# EAGLE design 10DOFATMEGAWSD (EAGLE 7.5.0)
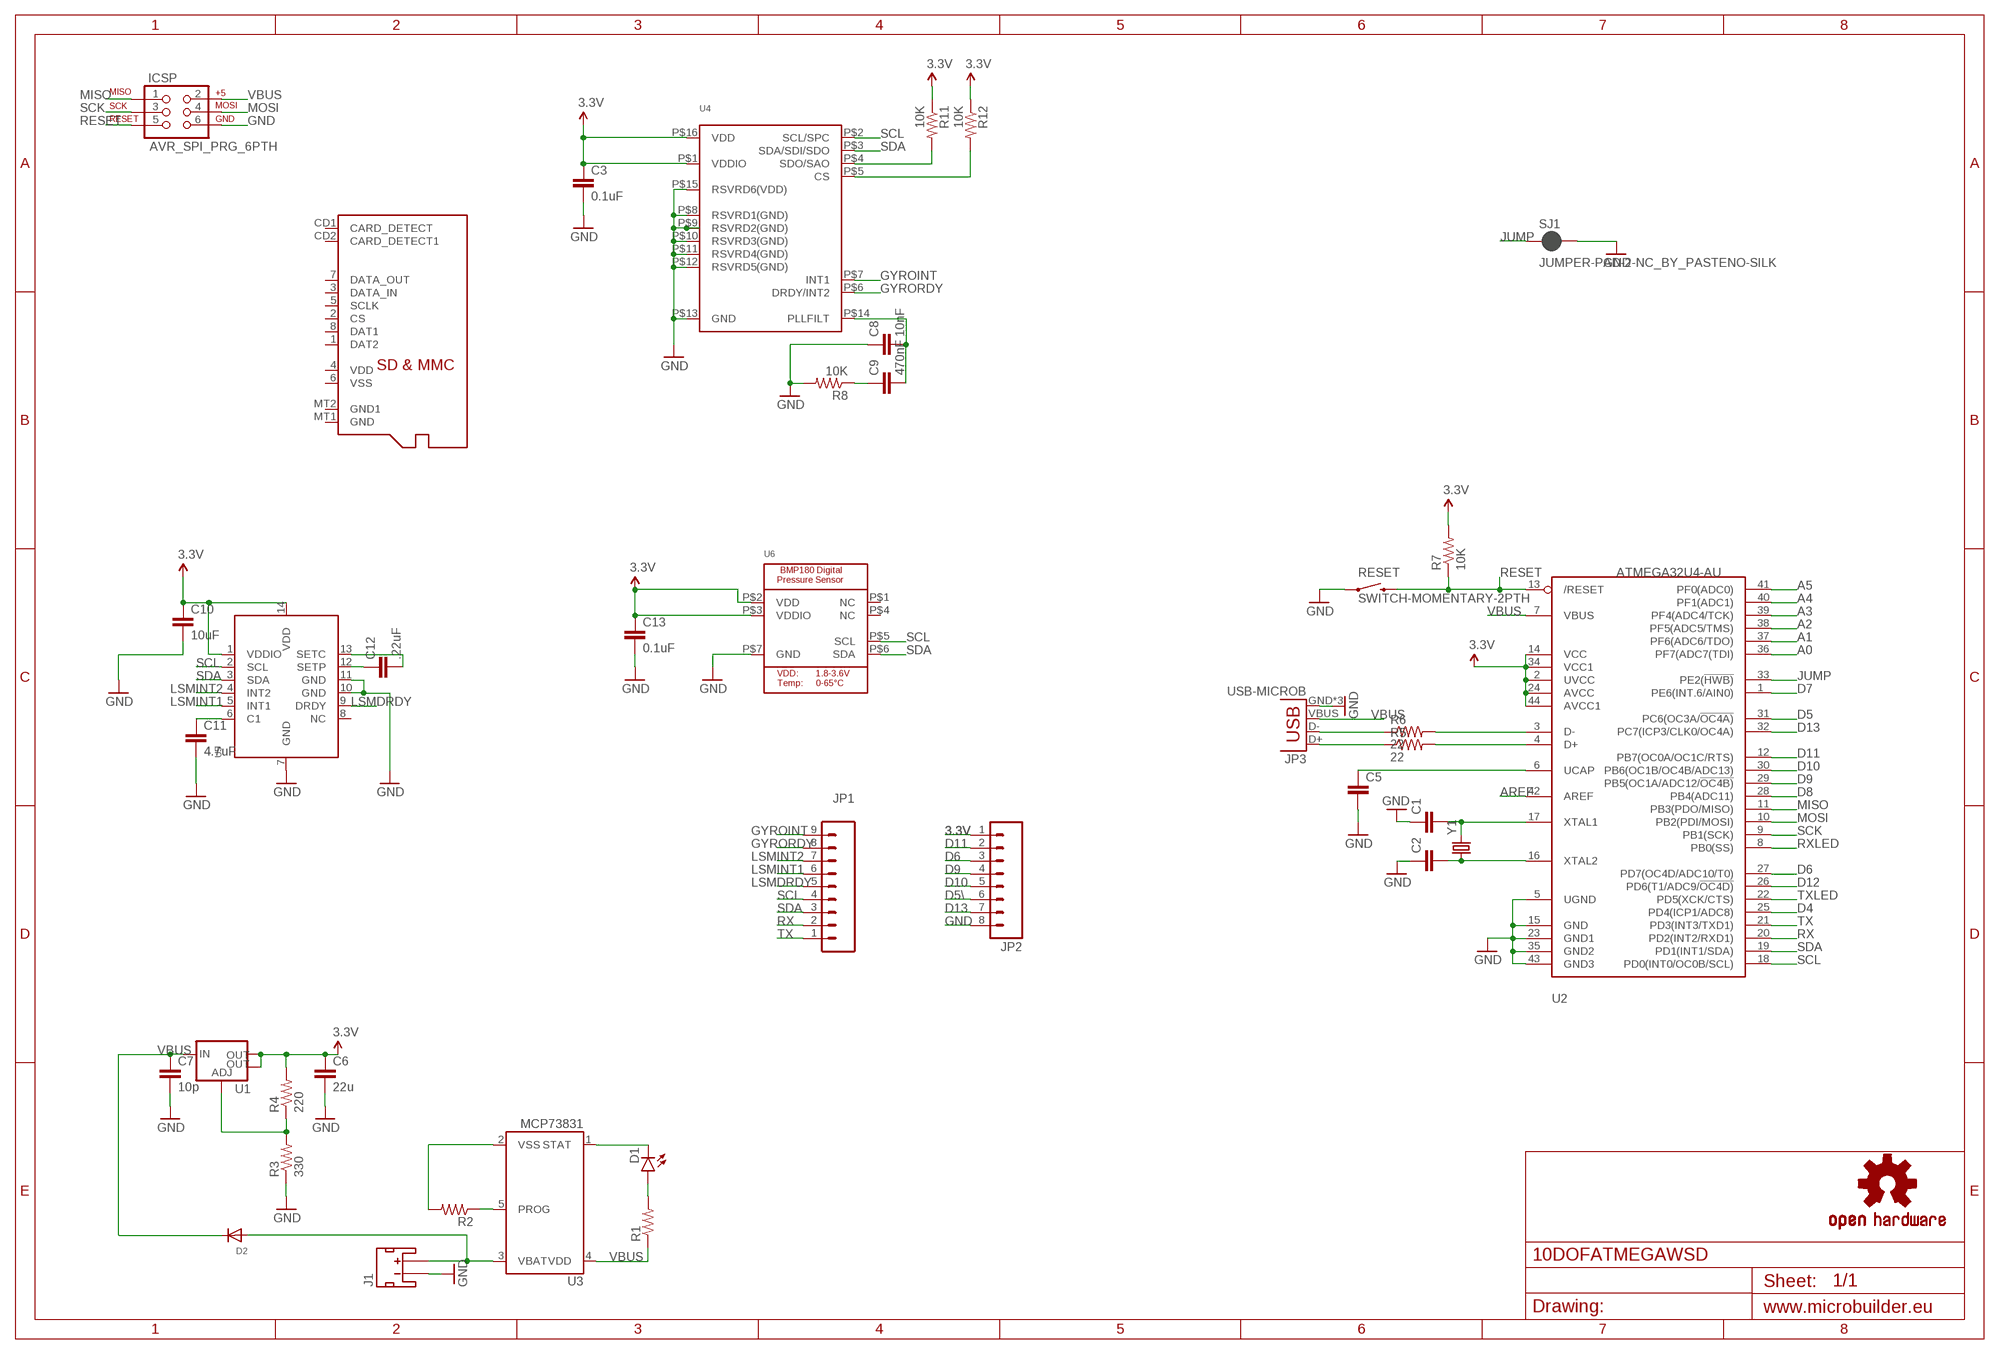
[diagram p0: schematic, sheet 1]

## Parts
C1  CAP0603-CAP  [0603-CAP]
C2  CAP0603-CAP  [0603-CAP]
C3  0.1uF  CAP0603-CAP  [0603-CAP]
C5  CAP0603-CAP  [0603-CAP]
C6  22u  CAP0603-CAP  [0603-CAP]
C7  10p  CAP0603-CAP  [0603-CAP]
C8  10nF  CAP0603-CAP  [0603-CAP]
C9  470nF  CAP0603-CAP  [0603-CAP]
C10  10uF  CAP0603-CAP  [0603-CAP]
C11  4.7uF  CAP0603-CAP  [0603-CAP]
C12  .22uF  CAP0603-CAP  [0603-CAP]
C13  0.1uF  CAP0603-CAP  [0603-CAP]
D1  LED3MM  [LED3MM]
D2  DIODESOT23_REFLOW  [SOT23-R]
ICSP  AVR_SPI_PRG_6PTH  [2X3]
J1  JST_2MM_MALE  [JST-2-SMD]
JP1  M09  [1X09]
JP2  M08  [1X08_ROUND]
JP3  USB-MICROB  [USB-MICROB]
LOGO1  OSHW-LOGOS-COPPER  [OSHW-LOGO-S_COPPER]
R1  RESISTOR0603-RES  [0603-RES]
R2  RESISTOR0603-RES  [0603-RES]
R3  330  RESISTOR0603-RES  [0603-RES]
R4  220  RESISTOR0603-RES  [0603-RES]
R5  22  RESISTOR0603-RES  [0603-RES]
R6  22  RESISTOR0603-RES  [0603-RES]
R7  10K  10KOHM-1/10W-1%(0603)0603  [0603-RES]
R8  10K  10KOHM-1/10W-1%(0603)0603  [0603-RES]
R11  10K  10KOHM-1/10W-1%(0603)0603  [0603-RES]
R12  10K  10KOHM-1/10W-1%(0603)0603  [0603-RES]
RESET  SWITCH-MOMENTARY-2PTH  [TACTILE-PTH]
SJ1  JUMPER-PAD-2-NC_BY_PASTENO-SILK  [PAD-JUMPER-2-NC_BY_PASTE_NO_SILK]
U1  V_REG_LM1117SOT223  [SOT223]
U2  ATMEGA32U4-AU  [TQFP44]
U3  MCP73831  [SOT23-5]
U4  GYRO_L3G2400D  [L3G4200D_LGA16L]
U5  LSM303DLHC  [LGA14]
U6  BMP180EXT  [BMP180_EXTENDED]
U$1  MICROSD  [MICROSD]
Y1  CRYSTALHC49US  [HC49US]

## Nets
3.3V: C3.1 C6.1 C10.1 C13.1 JP2.1 R4.2 R7.2 R11.1 R12.1 U1.2(OUT) U1.4(OUT) U2.2(UVCC) U2.14(VCC) U2.24(AVCC) U2.34(VCC1) U2.44(AVCC1) U4.P$1(VDDIO) U4.P$16(VDD) U5.1(VDDIO) U5.14(VDD) U6.P$2(VDD) U6.P$3(VDDIO)
A0: U2.36(PF7(ADC7(TDI))
A1: U2.37(PF6(ADC6/TDO))
A2: U2.38(PF5(ADC5/TMS))
A3: U2.39(PF4(ADC4/TCK))
A4: U2.40(PF1(ADC1))
A5: U2.41(PF0(ADC0))
AREF: U2.42(AREF)
D4: U2.25(PD4(ICP1/ADC8))
D5: U2.31(PC6(OC3A/!OC4A))
D5\: JP2.6
D6: JP2.3 U2.27(PD7(OC4D/ADC10/T0))
D7: U2.1(PE6(INT.6/AIN0))
D8: U2.28(PB4(ADC11))
D9: JP2.4 U2.29(PB5(OC1A/ADC12/!OC4B))
D10: JP2.5 U2.30(PB6(OC1B/OC4B/ADC13))
D11: JP2.2 U2.12(PB7(OC0A/OC1C/RTS))
D12: U2.26(PD6(T1/ADC9/!OC4D))
D13: JP2.7 U2.32(PC7(ICP3/CLK0/OC4A))
GND: C1.1 C2.1 C3.2 C5.2 C6.2 C7.2 C8.1 C10.2 C11.2 C13.2 ICSP.6 J1.1(-) JP2.8 JP3.GND JP3.MT1(GND) JP3.MT2(GND) R3.1 R8.2 RESET.1 SJ1.2 U2.5(UGND) U2.15(GND) U2.23(GND1) U2.35(GND2) U2.43(GND3) U4.P$8(RSVRD1(GND)) U4.P$9(RSVRD2(GND)) U4.P$10(RSVRD3(GND)) U4.P$11(RSVRD4(GND)) U4.P$12(RSVRD5(GND)) U4.P$13(GND) U4.P$15(RSVRD6(VDD)) U5.7(GND) U5.10(GND) U5.11(GND) U6.P$7(GND)
GYROINT: JP1.9 U4.P$7(INT1)
GYRORDY: JP1.8 U4.P$6(DRDY/INT2)
JUMP: SJ1.1 U2.33(PE2(!HWB))
LSMDRDY: JP1.5 U5.9(DRDY)
LSMINT1: JP1.6 U5.5(INT1)
LSMINT2: JP1.7 U5.4(INT2)
MISO: ICSP.1 U2.11(PB3(PDO/MISO))
MOSI: ICSP.4 U2.10(PB2(PDI/MOSI))
N$1: C2.2 U2.16(XTAL2) Y1.1
N$2: C1.2 U2.17(XTAL1) Y1.2
N$3: R5.2 U2.4(D+)
N$4: R6.2 U2.3(D-)
N$6: R2.1 U3.5(PROG)
N$7: R2.2 U3.2(VSS)
N$8: D1.K(C) U3.1(STAT)
N$9: D1.A R1.2
N$10: JP3.D+ R5.1
N$11: R3.2 R4.1 U1.1(ADJ)
N$12: JP3.D- R6.1
N$21: R11.2 U4.P$4(SDO/SAO)
N$22: D2.1(A) J1.2(+) U3.3(VBAT)
N$23: R12.2 U4.P$5(CS)
N$24: C8.2 C9.2 U4.P$14(PLLFILT)
N$26: C9.1 R8.1
N$28: C11.1 U5.6(C1)
N$31: C12.2 U5.13(SETC)
N$32: C12.1 U5.12(SETP)
N$69: C5.1 U2.6(UCAP)
RESET: ICSP.5 R7.1 RESET.3 U2.13(/RESET)
RX: JP1.2 U2.20(PD2(INT2/RXD1))
RXLED: U2.8(PB0(SS))
SCK: ICSP.3 U2.9(PB1(SCK))
SCL: JP1.4 U2.18(PD0(INT0/OC0B/SCL)) U4.P$2(SCL/SPC) U5.2(SCL) U6.P$5(SCL)
SDA: JP1.3 U2.19(PD1(INT1/SDA)) U4.P$3(SDA/SDI/SDO) U5.3(SDA) U6.P$6(SDA)
TX: JP1.1 U2.21(PD3(INT3/TXD1))
TXLED: U2.22(PD5(XCK/CTS))
VBUS: C7.1 D2.3(C) ICSP.2 JP3.VBUS R1.1 U1.3(IN) U2.7(VBUS) U3.4(VDD)
Unconnected: J1.NC1(PAD1) J1.NC2(PAD2) U5.8(NC) U6.P$1(NC) U6.P$4(NC) U$1.1(DAT2) U$1.2(CS) U$1.3(DATA_IN) U$1.4(VDD) U$1.5(SCLK) U$1.6(VSS) U$1.7(DATA_OUT) U$1.8(DAT1) U$1.CD1(CARD_DETECT) U$1.CD2(CARD_DETECT1) U$1.MT1(GND) U$1.MT2(GND1)

## Library data of the parts
C1-C3 C5-C13 = SparkFun-Capacitors:CAP: Capacitor Standard 0603 ceramic capacitor, and 0.1" leaded capacitor.
D1 = SparkFun-LED:LED: LEDs Standard schematic elements and footprints for 5mm, 3mm, 1206, and 0603 sized LEDs. 5mm - Spark Fun Electronics SKU : COM-00529 (and others)
D2 = adafruit:DIODE: Diode SMADIODE - SMA Surface Mount Package 20V 1A Schottky Diode Digikey: 641-1014-6-ND DO-1N4148 - Through Hole Small Current Diode SOD-123 20V 1 A (.5mV Vf) Schottky Diode - Digikey: MBRX120TPMSCT-ND SOD-323 10V 570mA (.38mV Vf, 3ns) Schottky Diode - Digikey: ZLLS410CT-ND SOD-523 30V 30mA Schottky Diode (RB751S-40TE61) - Digikey: RB751S-40TE61CT-ND SOT23-R/W - SOT23 Package (R = Solder Paste/Reflow Ovens, W = Hand-Soldering) BAT54Film 40V 300mA - Digikey: 497-7162-1-ND
ICSP = SparkFun-Connectors:AVR_SPI_PRG_6: AVR ISP 6 Pin This is the reduced ISP connector for AVR programming. Common on Arduino. This footprint will take up less PCB space and can be used with a 10-pin to 6-pin adapter such as SKU: BOB-08508 **Special note about "TEST_POINT" package. The stop mask is on the top side, so if you want your programming test points to be on the bottom of your board, make sure to place this package on the bottom side of the board. This also ensure that the orientation to program from the bottom side will be correct.
J1 = SparkFun-Connectors:JST_2MM_MALE: Mates to single-cell LiPo batteries. CONN-11443 Now with smashable polarity marks!; BTM_NEG: -; BTM_POS: +; PROD_ID: CONN-11443; TOP_NEG: -; TOP_POS: +
JP1 = SparkFun-Connectors:M09: Header 9 Standard 9-pin 0.1" header. Use with straight break away headers (SKU : PRT-00116), right angle break away headers (PRT-00553), swiss pins (PRT-00743), machine pins (PRT-00117), and female headers (PRT-00115).
JP2 = SparkFun-Connectors:M08: Header 8 Standard 8-pin 0.1" header. Use with straight break away headers (SKU : PRT-00116), right angle break away headers (PRT-00553), swiss pins (PRT-00743), machine pins (PRT-00117), and female headers (PRT-00115).
JP3 = SparkFun-Connectors:USB: USB Connectors USB-B-PTH is fully proven SKU : PRT-00139/CONN-08278 USB-miniB is fully proven SKU : PRT-00587 USB-A-PCB is untested. USB-A-H is throughly reviewed, but untested. Spark Fun Electronics SKU : PRT-00437 USB-B-SMT is throughly reviewed, but untested. Needs silkscreen touching up. USB-A-S has not been used/tested USB-MB-H has not been used/tested USB-MICROB has been used. CONN-09505; PROD_ID: CONN-09505
LOGO1 = SparkFun-Aesthetics:OSHW-LOGO: Open Source Hardware Logo This logo indicates the piece of hardware it is found on incorporates a OSHW license and/or adheres to the definition of open source hardware found here: http://freedomdefined.org/OSHW
R1-R6 = SparkFun-Resistors:RESISTOR: Resistor Basic schematic elements and footprints for 0603, 1206, and PTH resistors.
R7 R8 R11 R12 = SparkFun-Resistors:10KOHM-1/10W-1%(0603): RES-00824; PROD_ID: RES-00824
RESET = SparkFun-Electromechanical:SWITCH-MOMENTARY-2: Various NO switches- pushbuttons, reed, etc; PROD_ID: SWCH-08441
SJ1 = SparkFun-Passives:JUMPER-PAD-2-NC_BY_PASTE
U1 = SparkFun-PowerIC:V_REG_LM1117: Voltage Regulator LM1117 Standard adjustable voltage regulator but in SMD form. Spark Fun Electronics SKU : COM-00595; PROD_ID: VREG-08170
U2 = adafruit:ATMEGA32U4: http://www.ladyada.net/library/eagle
U3 = GeekAmmo:MCP73831: MCP73831 Miniature Single-Cell, Fully Integrated Li-Ion, Li-Polymer Charge Management Controllers The MCP73831/2 devices are highly advanced linear charge management controllers for use in spacelimited, cost-sensitive applications. http://ww1.microchip.com/downloads/en/DeviceDoc/20001984F.pdf
U4 = microbuilderLib:GYRO_L3G2400D: L3G4200D - 3-Axis MEMS gyroscope/motion sensor Three selectable scales: 250/500/2000 dps 1²C/SPI Interface 16-bit data 8-bit temperature VDD: 2.4-3.6V (IO 1.8V compatible) -40°C-85°C
U5 = Adafuit_10DOF:LSM303DLHC: LSM303DLHC 3-Axis I2C Accelerometer and 3-Axis Magnetometer VDD: 2.2-3.6V VDDIO: 1.8-VDD Magnetic Range: +/-1.3 to +/-8.1 gauss Accel Range: +/-2/4/8/16 g Temp: -40 - 85°C
U6 = Adafuit_10DOF:BMP180: BMP180 Digital Pressure Sensor 1.8-3.6V Supply, I2C Interface
U$1 = adafruit:MICROSD: Micro-SD / Transflash card holder with SPI pinout For the 3M # 2908-05WB-MG and/or 4UCON #19656 push-push type
Y1 = SparkFun-FreqCtrl:CRYSTAL: Various standard crystals. Proven footprints.

## Board
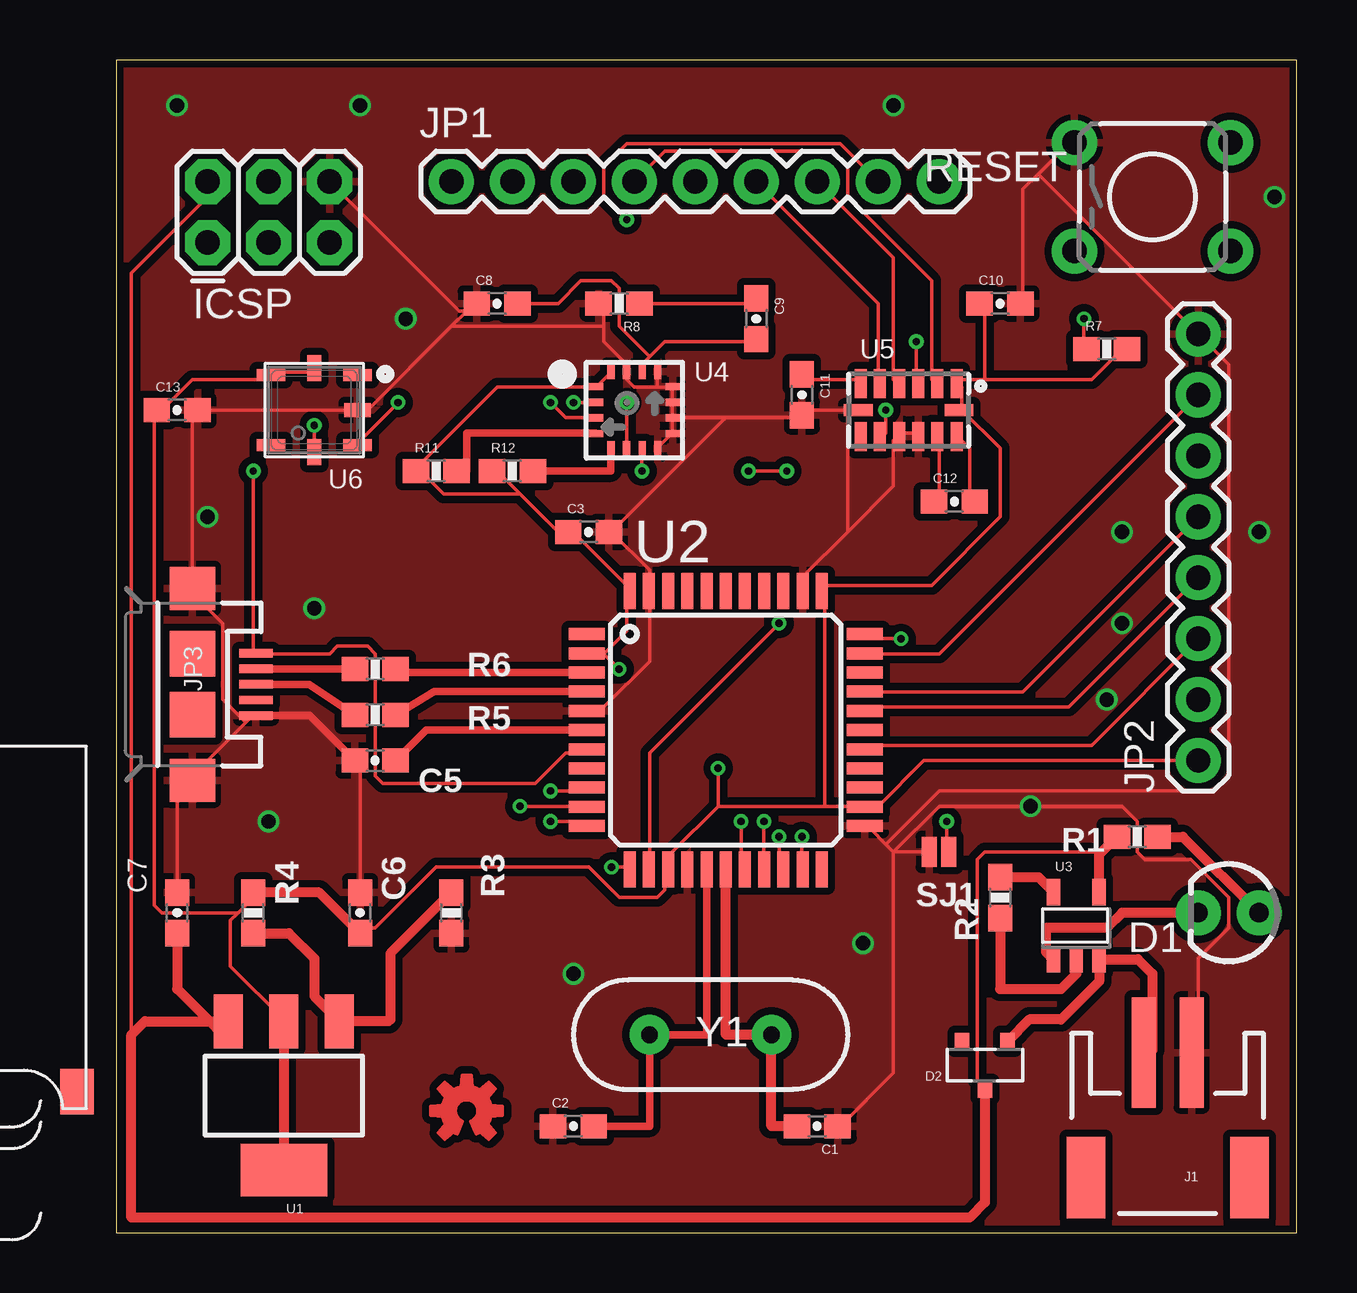
[diagram p1: board, top side]
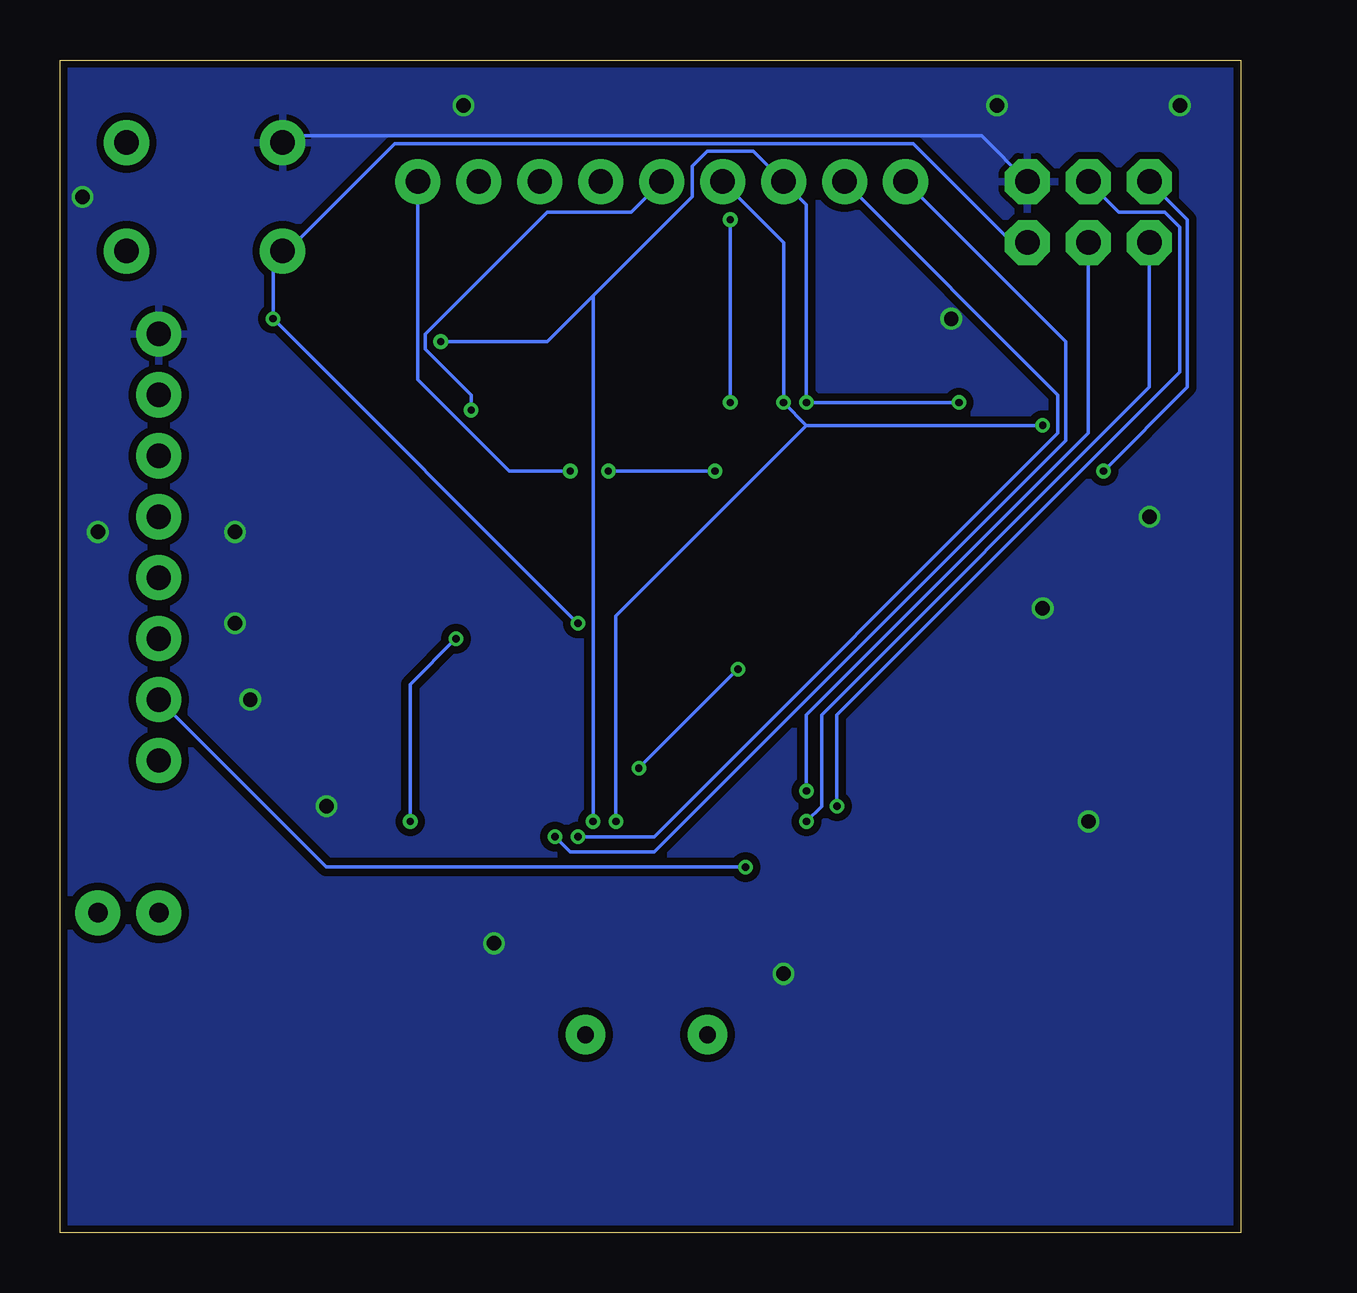
[diagram p2: board, bottom side, seen from below]

Size 49.2 x 48.88 mm. Coordinates in mm from the lower left corner, seen from the top.
Outline: 0,0 49.2,0 49.2,48.88 0,48.88 0,0
Copper layers (1*16): Top 0.035mm / dielectric 1.5mm / Bottom 0.035mm
Design rules "SeeedStudio_2layer_DRU_no_angle_20140221 *": minimum track width 6mil, minimum drill 12mil, track to track 6mil, track to pad 6mil, pad to pad 6mil, via to via 6mil, smd to smd 0mil, copper to edge 10mil, drill to drill 10mil, minimum pad ring 10mil, minimum via ring 6mil, stop-mask expansion 2mil, vias tented up to drill 100mil, thermal gap 10mil

### Footprints (pad centres in the part's own frame; a part is rotated, then mirrored left to right if it is on the bottom)
0603-CAP = smd 1.1 x 1: 1 -0.85,0; 2 0.85,0
LED3MM = drill 0.813 pad 1.88: A -1.27,0; K 1.27,0
SOT23-R = smd 0.6 x 0.7: 1 -0.95,-1; 2 0.95,-1; 3 0,1
2X3 = drill 1.016 pad 1.88 octagon: 1 0,0; 2 0,2.54; 3 2.54,0; 4 2.54,2.54; 5 5.08,0; 6 5.08,2.54
JST-2-SMD = smd 1 x 4.6: 1 -1,-3.7; 2 1,-3.7 | smd 1.6 x 3.4: NC1 -3.4,1.5; NC2 3.4,1.5
1X09 = drill 1.016 pad 1.88: 1 0,0; 2 2.54,0; 3 5.08,0; 4 7.62,0; 5 10.16,0; 6 12.7,0; 7 15.24,0; 8 17.78,0; 9 20.32,0
1X08_ROUND = drill 1.016 pad 1.88: 1 0,0; 2 2.54,0; 3 5.08,0; 4 7.62,0; 5 10.16,0; 6 12.7,0; 7 15.24,0; 8 17.78,0
USB-MICROB = smd 0.35 x 1.4: D+ 0,2.65; D- -0.65,2.65; GND 1.3,2.65; ID 0.65,2.65; VBUS -1.3,2.65 | smd 1.8 x 1.9: MT1 -4,0; MT2 4,0 | smd 1.9 x 1.9: P$1 -1.27,0; P$2 1.27,0
0603-RES = smd 1.1 x 1: 1 -0.85,0; 2 0.85,0
TACTILE-PTH = drill 1.016 pad 1.88: 1 -3.251,2.261; 2 3.251,2.261; 3 -3.251,-2.261; 4 3.251,-2.261
PAD-JUMPER-2-NC_BY_PASTE_NO_SILK = smd 0.635 x 1.27: 1 -0.401,0; 2 0.413,0
SOT223 = smd 1.219 x 2.235: 1 -2.311,-3.099; 2 0,-3.099; 3 2.311,-3.099 | smd 3.6 x 2.2: 4 0,3.099
TQFP44 = smd 1.5 x 0.5: 1 -5.8,4; 2 -5.8,3.2; 3 -5.8,2.4; 4 -5.8,1.6; 5 -5.8,0.8; 6 -5.8,0; 7 -5.8,-0.8; 8 -5.8,-1.6; 9 -5.8,-2.4; 10 -5.8,-3.2; 11 -5.8,-4; 23 5.8,-4; 24 5.8,-3.2; 25 5.8,-2.4; 26 5.8,-1.6; 27 5.8,-0.8; 28 5.8,0; 29 5.8,0.8; 30 5.8,1.6; 31 5.8,2.4; 32 5.8,3.2; 33 5.8,4 | smd 0.5 x 1.5: 12 -4,-5.8; 13 -3.2,-5.8; 14 -2.4,-5.8; 15 -1.6,-5.8; 16 -0.8,-5.8; 17 0,-5.8; 18 0.8,-5.8; 19 1.6,-5.8; 20 2.4,-5.8; 21 3.2,-5.8; 22 4,-5.8; 34 4,5.8; 35 3.2,5.8; 36 2.4,5.8; 37 1.6,5.8; 38 0.8,5.8; 39 0,5.8; 40 -0.8,5.8; 41 -1.6,5.8; 42 -2.4,5.8; 43 -3.2,5.8; 44 -4,5.8
SOT23-5 = smd 0.55 x 1.1: 1 -0.95,-1.3; 2 0,-1.3; 3 0.95,-1.3; 4 0.95,1.5; 5 -0.95,1.5
L3G4200D_LGA16L = smd 0.6 x 0.3: P$1 -1.6,0.975; P$2 -1.6,0.325; P$3 -1.6,-0.325; P$4 -1.6,-0.975; P$9 1.6,-0.975; P$10 1.6,-0.325; P$11 1.6,0.325; P$12 1.6,0.975 | smd 0.3 x 0.6: P$5 -0.975,-1.6; P$6 -0.325,-1.6; P$7 0.325,-1.6; P$8 0.975,-1.6; P$13 0.975,1.6; P$14 0.325,1.6; P$15 -0.325,1.6; P$16 -0.975,1.6
LGA14 = smd 0.5 x 1.2: 1 2,1.1; 2 1.2,1.1; 3 0.4,1.1; 4 -0.4,1.1; 5 -1.2,1.1; 6 -2,1.1; 8 -2,-1.1; 9 -1.2,-1.1; 10 -0.4,-1.1; 11 0.4,-1.1; 12 1.2,-1.1; 13 2,-1.1 | smd 1.2 x 0.5: 7 -2.1,0; 14 2.1,0
BMP180_EXTENDED = smd 1.2 x 0.5: P$1 -1.8,-1.45; P$3 1.8,-1.45; P$4 1.8,1.45; P$6 -1.8,1.45 | smd 0.6 x 1.1: P$2 0,-1.75; P$5 0,1.75 | smd 1.1 x 0.6: P$7 -1.8,0
MICROSD = smd 0.7 x 1.5: 1 9,-10.64; 2 7.9,-10.24; 3 6.8,-10.64; 4 5.7,-11.04; 5 4.6,-10.64; 6 3.5,-11.04; 7 2.4,-10.64; 8 1.3,-10.64 | smd 1.8 x 1.4: CD1 2,-0.44; CD2 8,-0.44 | smd 1.4 x 1.9: MT1 0.4,-13.54; MT2 13.6,-14.44
HC49US = drill 0.7 pad 1.651: 1 -2.54,0; 2 2.54,0

### Placement (x,y rotation side)
C1  29.21,4.45 180 top
C2  19.05,4.45 0 top
C3  19.68,29.21 0 top
C5  10.79,19.68 180 top
C6  10.16,13.34 90 top
C7  2.54,13.34 90 top
C8  15.88,38.73 0 top
C9  26.67,38.1 270 top
C10  36.83,38.73 0 top
C11  28.57,34.92 270 top
C12  34.92,30.48 0 top
C13  2.54,34.29 0 top
D1  46.35,13.34 180 top
D2  36.2,6.99 180 top
ICSP  3.81,41.27 0 top
J1  43.81,3.81 180 top
JP1  13.97,43.81 0 top
JP2  45.09,19.68 90 top
JP3  3.17,22.86 270 top
LOGO1  14.61,5.08 0 top
R1  42.55,16.51 0 top
R2  36.83,13.97 270 top
R3  13.97,13.34 90 top
R4  5.71,13.34 90 top
R5  10.79,21.59 0 top
R6  10.79,23.5 0 top
R7  41.27,36.83 0 top
R8  20.95,38.73 180 top
R11  13.34,31.75 0 top
R12  16.51,31.75 0 top
RESET  43.18,43.18 0 top
SJ1  34.29,15.88 180 top
U1  6.99,5.71 180 top
U2  25.4,20.95 0 top
U3  40.01,12.7 0 top
U4  21.59,34.29 0 top
U5  33.02,34.29 0 top
U6  8.26,34.29 180 top
U$1  -15.24,20.32 0 top
Y1  24.77,8.26 0 top

### Tracks (layer width: path | path; a pad name or v marks a point on that pad's centre or on a via)
3.3V  (via drill 0.3)
  Top 0.152: 20,35.24 20.64,35.88 U4.P$16 | 20,35.24 15.88,35.24 12.38,31.75 R11.1 12.7,31.75 13.65,30.8 16.83,30.8 | 20,35.24 U4.P$1 | 16.83,30.8 18.41,29.21 C3.1 19.05,29.21 21.27,26.99 U2.44 21.27,26.67 21.27,25.08 20.32,24.13 | 16.83,30.8 15.88,31.75 R12.1 | 20.32,24.13 19.68,24.13 U2.2 20.32,24.13 | 36.2,35.56 35.24,35.56 U5.1 35.24,35.24 35.24,34.29 | 36.2,35.56 40.64,35.56 41.91,36.83 R7.2 | 36.2,35.56 36.2,38.73 C10.1 | U6.P$2 8.26,35.88 6.67,35.88 U6.P$3 6.35,35.56 3.17,35.56 1.91,34.29 C13.1 1.59,34.29 1.59,13.65 1.91,13.34 5.08,13.34 | 5.08,13.34 4.76,13.02 4.76,11.11 6.99,8.89 U1.2 | 5.08,13.34 5.71,13.97 R4.2 | 25.08,17.78 23.18,15.88 23.18,15.24 U2.14 22.86,14.92 22.86,14.29 22.54,13.97 20.95,13.97 19.68,15.24 13.34,15.24 10.79,12.7 10.16,12.7 C6.1 | 29.53,17.78 31.11,17.78 U2.24 31.43,17.78 31.75,17.78 33.66,19.68 JP2.1 | 29.53,17.78 25.08,17.78 | 29.53,17.78 29.53,26.67 U2.34 29.53,26.99 33.97,26.99 36.83,29.84 36.83,32.7 35.24,34.29 | 35.24,34.29 U5.14 | v20.95,23.5 20.32,24.13 | 25.08,17.78 v25.08,19.37
  Top 0.406: U1.2 U1.4 | C6.1 8.46,14.19 R4.2
  Bottom 0.152: v25.08,19.37 v20.95,23.5
D6
  Top 0.152: JP2.3 40.64,20.32 31.43,20.32 U2.27
D9
  Top 0.152: JP2.4 39.69,21.91 31.43,21.91 U2.29
D10
  Top 0.152: JP2.5 37.78,22.54 31.43,22.54 U2.30
D11  (via drill 0.3)
  Top 0.152: v20.64,15.24 21.27,15.24 U2.12
  Bottom 0.152: v20.64,15.24 38.1,15.24 JP2.2
D13
  Top 0.152: JP2.7 34.29,24.13 31.43,24.13 U2.32
GND  (via drill 0.6)
  Top 0.152: 32.38,15.88 SJ1.2 | 32.07,16.19 31.43,16.83 U2.23 | 32.07,16.19 32.38,15.88 | 32.38,15.88 32.38,6.67 30.16,4.45 C1.1 | 32.38,15.88 34.29,17.78 41.91,17.78 42.55,17.14 42.55,15.88 42.86,15.56 44.77,15.56 46.35,13.97 46.35,12.7 45.09,11.43 45.09,7.62 J1.1 | 20.64,29.21 22.23,27.62 22.23,26.99 U2.43 22.23,26.67 22.23,23.81 20.32,21.91 19.68,21.91 U2.5 | 23.18,33.34 22.54,32.7 U4.P$8 | 23.18,34.61 23.18,33.97 | 23.18,34.61 23.18,35.24 | 23.18,34.61 U4.P$11 | 21.27,35.88 21.27,35.56 21.59,35.24 22.54,35.24 | 23.18,35.24 22.54,35.24 | 23.18,35.24 U4.P$12 | 22.54,35.24 22.54,35.88 U4.P$13 | 23.18,33.97 23.18,33.34 | 23.18,33.34 U4.P$9 | 20.32,37.78 20.32,37.15 21.27,36.2 21.27,35.88 | 20.32,37.78 20.32,38.73 R8.2 | 21.27,35.88 U4.P$15 | 30.48,34.29 U5.7 30.8,34.29 | 30.48,34.29 28.57,34.29 C11.2 28.57,33.97 25.4,33.97 | U5.11 33.34,33.34 32.7,33.34 U5.10 32.38,33.02 32.38,31.11 30.48,29.21 | 30.48,29.21 28.57,27.3 28.57,26.99 U2.35 | 30.48,29.21 30.48,34.29 | 25.4,33.97 23.18,33.97 | 23.18,33.97 U4.P$10 | 25.4,33.97 20.64,29.21 | 20.64,29.21 C3.2 | 38.42,44.13 39.69,45.4 RESET.1 | 38.42,44.13 37.78,43.5 37.78,38.73 C10.2 | 38.42,44.13 JP2.8 46.35,36.2 46.35,19.05 45.72,18.41 34.29,18.41 32.07,16.19 | C6.2 10.16,19.68 C5.2 | C7.2 2.54,18.1 3.17,18.73 JP3.MT2 3.17,19.05 5.4,21.27 | 5.4,21.27 5.71,21.59 JP3.GND | 13.97,37.78 10.48,34.29 U6.P$7 C13.2 3.17,34.29 JP3.MT1 3.17,26.67 4.45,25.4 4.45,22.23 5.4,21.27 | 13.97,37.78 14.61,38.42 | 14.61,38.42 14.92,38.73 C8.1 14.61,38.42 | ICSP.6 14.29,38.42 14.61,38.42 | 13.97,37.78 20.32,37.78
  Top 0.305: C5.2 8.07,21.56 JP3.GND
  Bottom 0.152: ICSP.6 10.79,45.72 39.69,45.72 RESET.1
  other vias: 41.91,29.21 41.91,25.4 41.27,22.23 41.27,22.23 38.1,17.78 31.11,12.06 19.05,10.79 6.35,17.14 8.26,26.04 3.81,29.84 12.06,38.1 10.16,46.99 2.54,46.99 32.38,46.99 48.26,43.18 47.62,29.21
  pour Bottom (isolate 0.305): 0,48.9 49.53,48.9 49.53,-0.64 0,-0.64
  pour Top (isolate 0.305): 0,48.9 49.53,48.9 49.53,-0.64 0,-0.64
GYROINT  (via drill 0.3)
  Top 0.152: v21.91,31.75 21.91,32.7 U4.P$7 | v27.94,31.75 v26.35,31.75
  Bottom 0.152: v26.35,31.75 v21.91,31.75 | v27.94,31.75 30.48,31.75 34.29,35.56 JP1.9
GYRORDY  (via drill 0.3)
  Top 0.152: v21.27,34.61 21.27,32.7 U4.P$6 | v21.27,42.23 20.32,43.18 20.32,44.45 21.27,45.4 30.16,45.4 JP1.8
  Bottom 0.152: v21.27,42.23 v21.27,34.61
JUMP  (via drill 0.3)
  Top 0.152: v34.61,17.14 34.61,15.88 SJ1.1 | v32.7,24.77 31.43,24.77 U2.33
  Bottom 0.152: v34.61,17.14 34.61,22.86 v32.7,24.77
LSMDRDY  (via drill 0.3)
  Top 0.152: v32.07,34.29 32.07,33.34 U5.9
  Bottom 0.152: v32.07,34.29 32.07,34.92 33.97,36.83 33.97,37.47 28.89,42.55 25.4,42.55 JP1.5
LSMINT1
  Top 0.152: JP1.6 31.75,38.73 31.75,35.56 U5.5
LSMINT2
  Top 0.152: JP1.7 32.38,40.64 32.38,35.56 U5.4
MISO  (via drill 0.3)
  Top 0.152: v18.1,17.14 19.37,17.14 U2.11
  Bottom 0.152: v18.1,17.14 17.46,17.78 17.46,21.59 3.81,35.24 ICSP.1
MOSI  (via drill 0.3)
  Top 0.152: v16.83,17.78 19.37,17.78 U2.10
  Bottom 0.152: v16.83,17.78 16.83,21.59 2.54,35.88 2.54,41.91 3.17,42.55 5.08,42.55 ICSP.4
N$1
  Top 0.305: C2.2 22.23,4.45 Y1.1 24.6,8.26 U2.16
N$2
  Top 0.406: C1.2 27.3,4.45 Y1.2 25.4,8.26 U2.17
N$3
  Top 0.305: R5.2 13.24,22.55 U2.4
N$4
  Top 0.305: R6.2 11.79,23.36 U2.3
N$6
  Top 0.406: U3.5 38.44,14.82 R2.1
N$7
  Top 0.406: R2.2 36.83,10.16 39.37,10.16 40.01,10.79 U3.2
N$8
  Top 0.406: D1.K 41.91,13.34 41.27,12.7 38.73,12.7 38.73,11.72 U3.1
N$9
  Top 0.406: R1.2 44.45,16.51 D1.A
N$10
  Top 0.305: R5.1 8.04,22.86 JP3.D+
N$11
  Top 0.406: R4.1 7.2,12.48 8.26,11.43 8.26,9.86 U1.1 11.35,8.81 11.43,8.89 11.43,11.64 R3.2
N$12
  Top 0.305: JP3.D- 5.84,23.5 R6.1
N$21
  Top 0.305: R11.2 14.61,31.75 14.61,33.34 19.99,33.34 U4.P$4
N$22
  Top 0.406: D2.1 38.05,8.89 39.37,8.89 40.95,10.47 U3.3 42.58,11.4 43.18,10.79 43.18,7.62 42.55,6.99 42.55,7.24 J1.2
N$23
  Top 0.305: R12.2 20.61,31.75 U4.P$5
N$24
  Top 0.152: 22.23,36.51 22.86,37.15 26.67,37.15 C9.2 | 22.23,36.51 21.91,36.2 21.91,35.88 U4.P$14 | C8.2 18.41,38.73 19.37,39.69 20.64,39.69 20.95,39.37 20.95,37.78 22.23,36.51
N$26
  Top 0.152: R8.1 26.67,38.73 C9.1
N$28
  Top 0.152: C11.1 28.57,35.56 30.8,35.56 U5.6
N$31
  Top 0.152: C12.2 35.56,30.48 35.56,32.7 35.24,33.02 U5.13
N$32
  Top 0.152: C12.1 34.29,30.48 34.29,33.02 U5.12
N$69
  Top 0.305: C5.1 12.91,20.95 U2.6
RESET  (via drill 0.3)
  Top 0.152: v40.32,38.1 40.32,36.83 R7.1 | v27.62,25.4 22.23,20 22.23,15.24 U2.13
  Bottom 0.152: v27.62,25.4 v40.32,38.1 40.32,40.32 40.01,40.64 RESET.3 39.69,40.96 35.24,45.4 13.65,45.4 9.53,41.27 ICSP.5
RX  (via drill 0.3)
  Top 0.152: v27.62,16.51 27.62,15.24 U2.20
  Bottom 0.152: v27.62,16.51 24.45,16.51 7.62,33.34 7.62,34.92 JP1.2
SCK  (via drill 0.3)
  Top 0.152: v18.1,18.41 19.37,18.41 U2.9
  Bottom 0.152: v18.1,18.41 18.1,21.59 6.35,33.34 ICSP.3
SCL  (via drill 0.3)
  Top 0.152: v19.05,34.61 20,34.61 U4.P$2 | v8.26,33.66 U6.P$5 | JP1.4 22.86,45.09 29.84,45.09 30.48,44.45 30.48,43.18 33.97,39.69 33.97,35.56 U5.2 | v26.04,17.14 26.04,15.24 U2.18
  Bottom 0.152: JP1.4 19.05,41.27 v19.05,34.61 18.1,33.66 | 18.1,33.66 v8.26,33.66 | v26.04,17.14 26.04,25.72 18.1,33.66
SDA  (via drill 0.3)
  Top 0.152: v18.1,34.61 18.73,33.97 20,33.97 U4.P$3 | v11.75,34.61 10.16,33.02 U6.P$6 | v33.34,37.15 33.34,35.56 U5.3 | v26.99,17.14 26.99,15.24 U2.19
  Bottom 0.152: v11.75,34.61 v18.1,34.61 18.1,42.86 JP1.3 20.32,45.09 22.23,45.09 22.86,44.45 22.86,43.18 26.99,39.05 | v33.34,37.15 28.89,37.15 26.99,39.05 | 26.99,39.05 v26.99,17.14
TX  (via drill 0.3)
  Top 0.152: v28.57,16.51 28.57,15.24 U2.21
  Bottom 0.152: v28.57,16.51 27.94,15.88 24.45,15.88 7.3,33.02 7.3,37.15 JP1.1
VBUS  (via drill 0.3)
  Top 0.152: U2.7 19.37,20 18.73,20 17.46,18.73 11.11,18.73 10.79,19.05 10.79,24.13 10.48,24.45 9.21,24.45 8.89,24.13 6.03,24.13 JP3.VBUS 5.71,24.13 v5.71,31.75 | 40.95,15.77 40.96,15.88 36.2,15.88 35.88,15.56 35.88,6.35 36.2,6.03 D2.3 | 3.81,8.89 3.81,8.81 | ICSP.2 3.81,43.18 0.64,40.01 0.64,8.26
  Top 0.406: C7.1 2.54,10.16 3.81,8.89 4.45,8.26 | U3.4 40.95,15.77 R1.1 | D2.3 36.2,1.27 35.56,0.64 0.64,0.64 0.64,8.26 1.19,8.81 3.81,8.81 U1.3
  Bottom 0.152: v5.71,31.75 2.22,35.24 2.22,42.23 ICSP.2